# Altium schematic sheet systems_wiring_diagram.SchDoc
size A4
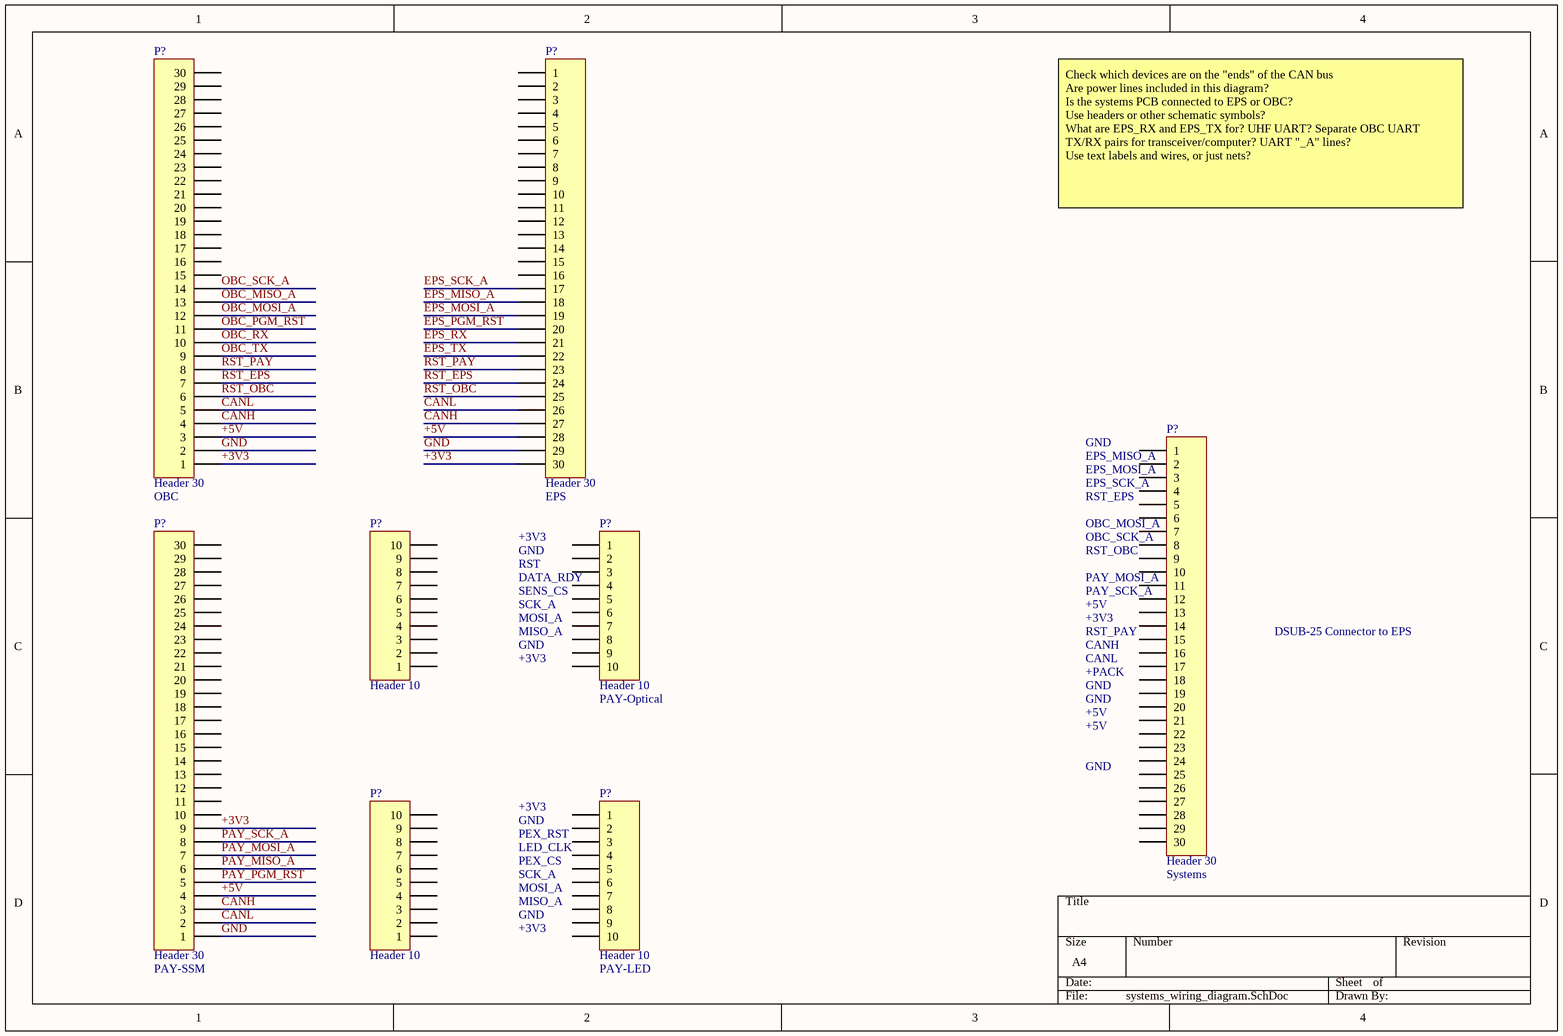
[diagram p0: systems_wiring_diagram.SchDoc]

## Parts
(Parts that share a designator on the sheet are numbered #1, #2 ... from top to bottom, then left to right.)
P?#1  Header 30  [HDR1X30]
P?#2  Header 30  [HDR1X30]
P?#3  Header 30  [HDR1X30]
P?#4  Header 10  [HDR1X10]
P?#5  Header 10  [HDR1X10]
P?#6  Header 10  [HDR1X10]
P?#7  Header 30  [HDR1X30]
P?#8  Header 10  [HDR1X10]

## Nets
+3V3: P?#1.30 P?#3.1 P?#7.9
+5V: P?#1.28 P?#3.3 P?#7.4
CANH: P?#1.27 P?#3.4 P?#7.3
CANL: P?#1.26 P?#3.5 P?#7.2
EPS_MISO_A: P?#1.18
EPS_MOSI_A: P?#1.19
EPS_PGM_RST: P?#1.20
EPS_RX: P?#1.21
EPS_SCK_A: P?#1.17
EPS_TX: P?#1.22
GND: P?#1.29 P?#3.2 P?#7.1
OBC_MISO_A: P?#3.13
OBC_MOSI_A: P?#3.12
OBC_PGM_RST: P?#3.11
OBC_RX: P?#3.10
OBC_SCK_A: P?#3.14
OBC_TX: P?#3.9
PAY_MISO_A: P?#7.6
PAY_MOSI_A: P?#7.7
PAY_PGM_RST: P?#7.5
PAY_SCK_A: P?#7.8
RST_EPS: P?#1.24 P?#3.7
RST_OBC: P?#1.25 P?#3.6
RST_PAY: P?#1.23 P?#3.8

Not connected (* = marked no-connect by the designer): P?#1 1 2 3 4 5 6 7 8 9 10 11 12 13 14 15 16; P?#2 1 2 3 4 5 6 7 8 9 10 11 12 13 14 15 16 17 18 19 20 21 22 23 24 25 26 27 28 29 30; P?#3 15 16 17 18 19 20 21 22 23 24 25 26 27 28 29 30; P?#4 1 2 3 4 5 6 7 8 9 10; P?#5 1 2 3 4 5 6 7 8 9 10; P?#6 1 2 3 4 5 6 7 8 9 10; P?#7 10 11 12 13 14 15 16 17 18 19 20 21 22 23 24 25 26 27 28 29 30; P?#8 1 2 3 4 5 6 7 8 9 10

## Notes on the sheet
- Check which devices are on the "ends" of the CAN bus
  Are power lines included in this diagram?
  Is the systems PCB connected to EPS or OBC?
  Use headers or other schematic symbols?
  What are EPS_RX and EPS_TX for? UHF UART? Separate OBC UART TX/RX pairs for transceiver/computer? UART "_A" lines?
  Use text labels and wires, or just nets?
- GND
- (near P?#3) OBC
- (near P?#1) EPS
- (near P?#2) EPS_MISO_A
- (near P?#2) EPS_MOSI_A
- (near P?#2) EPS_SCK_A
- (near P?#2) RST_EPS
- +3V3
- RST
- (near P?#4) DATA_RDY
- (near P?#2) OBC_MOSI_A
- (near P?#2) OBC_SCK_A
- (near P?#2) RST_OBC
- (near P?#2) PAY_MOSI_A
- (near P?#4) SENS_CS
- (near P?#4) SCK_A
- (near P?#4) MOSI_A
- (near P?#4) MISO_A
- (near P?#2) PAY_SCK_A
- +5V
- (near P?#2) RST_PAY
- CANH
- DSUB-25 Connector to EPS
- (near P?#4) PAY-Optical
- CANL
- (near P?#2) +PACK
- (near P?#6) PEX_RST
- (near P?#6) LED_CLK
- (near P?#6) PEX_CS
- (near P?#6) SCK_A
- (near P?#6) MOSI_A
- (near P?#6) MISO_A
- (near P?#2) Systems
- (near P?#7) PAY-SSM
- (near P?#6) PAY-LED

## Library data of the parts
P?#1-P?#3 P?#7 = Header 30: Header, 30-Pin; LatestRevisionDate: 17-Jul-2002; LatestRevisionNote: Re-released for DXP Platform.; Publisher: Altium Limited
P?#4-P?#6 P?#8 = Header 10: Header, 10-Pin; LatestRevisionDate: 17-Jul-2002; LatestRevisionNote: Re-released for DXP Platform.; Publisher: Altium Limited